# EAGLE design ioshield (EAGLE 7.2.0)
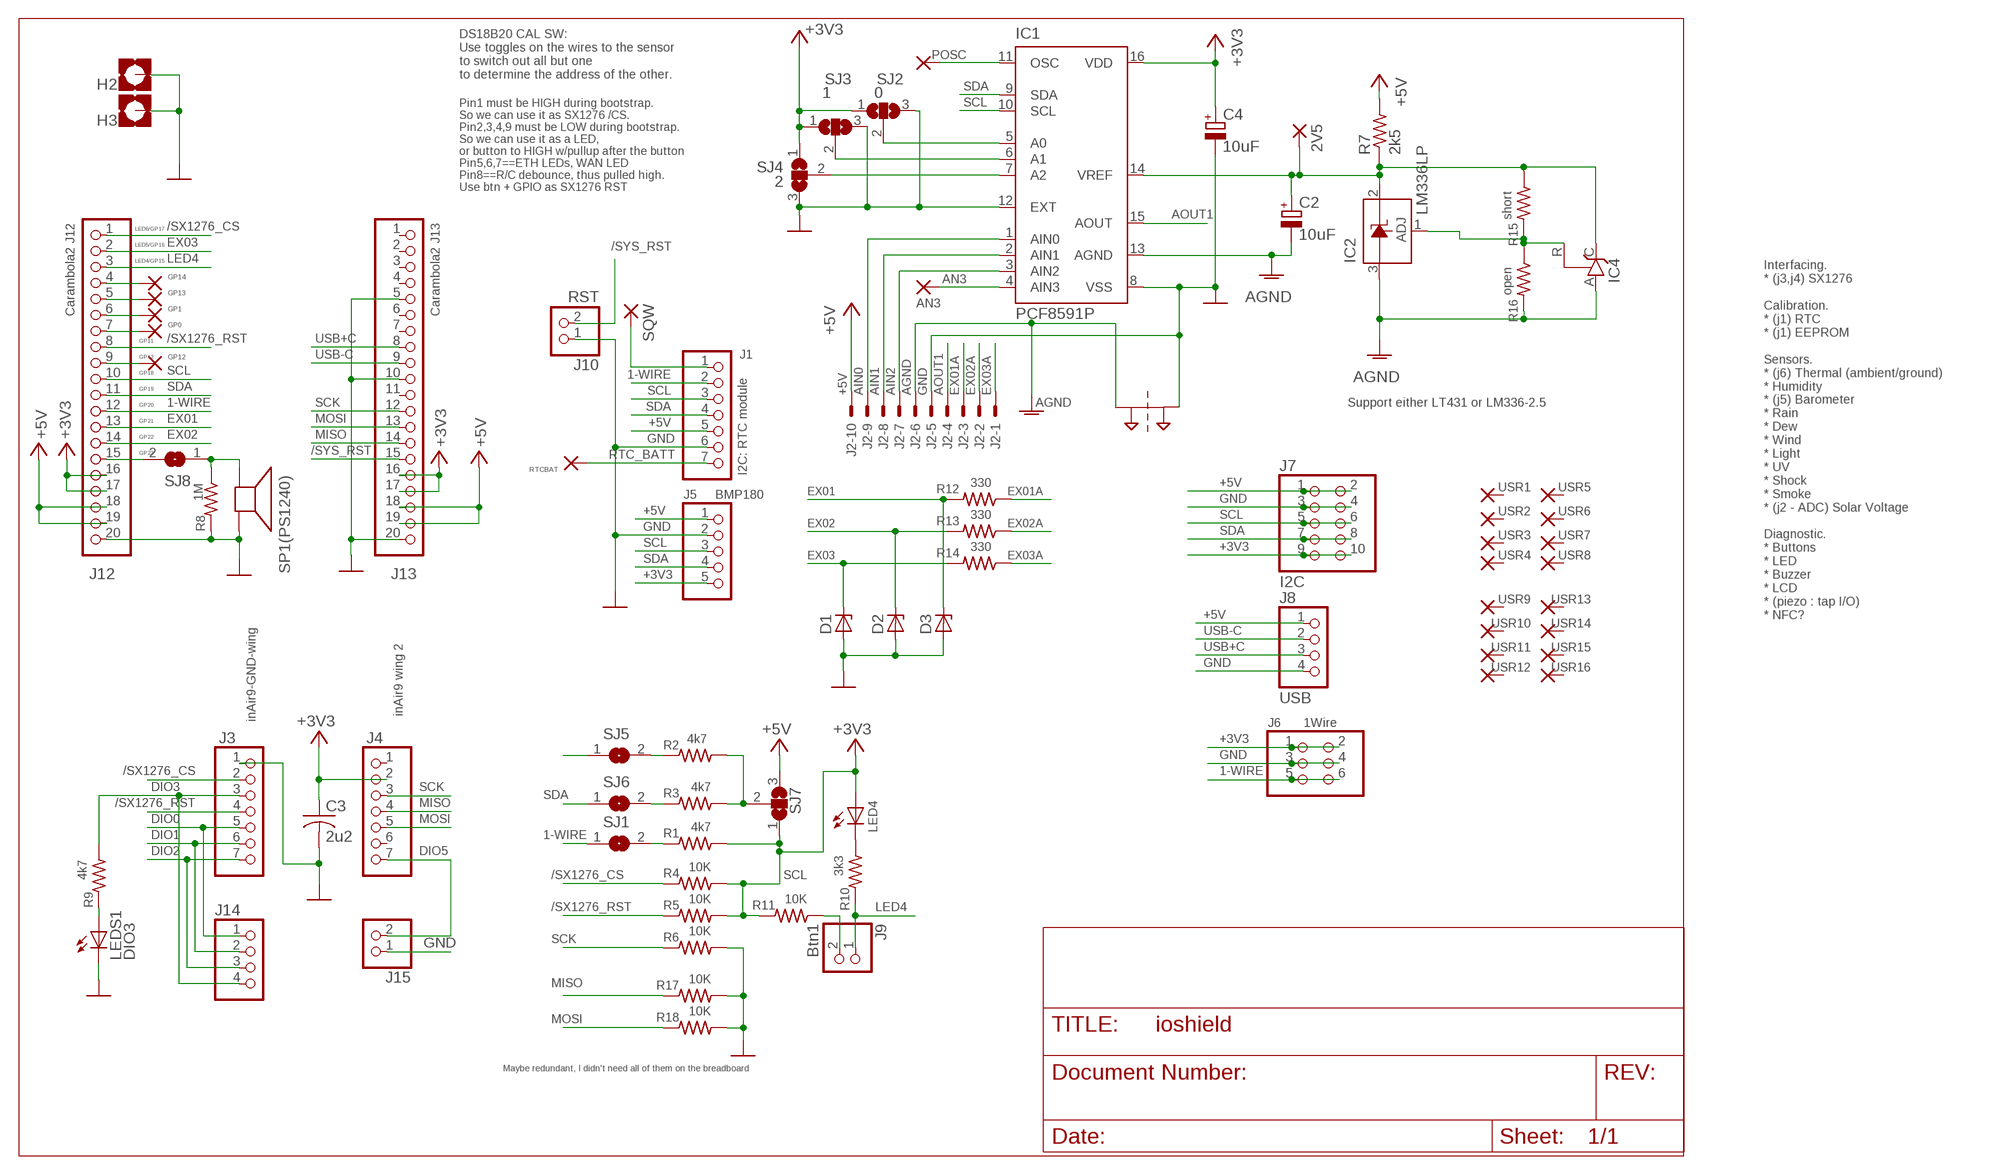
[diagram p0: schematic, sheet 1]

## Parts
2V5  2,54/0,8  [2,54/0,8]
AN3  AN3  2,54/0,8  [2,54/0,8]
C2  10uF  CPOL-EUE2.5-5  [E2,5-5]
C3  2u2  C-USC1206  [C1206]
C4  10uF  CPOL-EUE2.5-5  [E2,5-5]
D1  ZENER-DIODEZD-2.5  [ZDIO-2.5]
D2  ZENER-DIODEZD-2.5  [ZDIO-2.5]
D3  ZENER-DIODEZD-2.5  [ZDIO-2.5]
GP0  2,54/0,8  [2,54/0,8]
GP1  2,54/0,8  [2,54/0,8]
GP12  2,54/0,8  [2,54/0,8]
GP13  2,54/0,8  [2,54/0,8]
GP14  2,54/0,8  [2,54/0,8]
H2  MOUNT-PAD-SQUARE3.2  [3,2-PAD-SQUARE]
H3  MOUNT-PAD-SQUARE3.2  [3,2-PAD-SQUARE]
IC1  PCF8591P  [DIL16]
IC2  LM336LP  [TO92]
IC4  TL431CLP  [TO92-CLP]
J1  I2C: RTC module  PINHD-1X7  [1X07]
J2  22-23-2101  [22-23-2101]
J3  inAir9-GND-wing  PINHD-1X7  [1X07]
J4  inAir9 wing 2  PINHD-1X7  [1X07]
J5  BMP180  PINHD-1X5  [1X05]
J6  1Wire  PINHD-2X3  [2X03]
J7  I2C  PINHD-2X5  [2X05]
J8  USB  PINHD-1X4  [1X04]
J9  Btn1  PINHD-1X2  [1X02]
J10  RST  PINHD-1X2  [1X02]
J12  Carambola2 J12  PINHD-1X20  [1X20]
J13  Carambola2 J13  PINHD-1X20  [1X20]
J14  PINHD-1X4  [1X04]
J15  PINHD-1X2  [1X02]
LED4  LED3MM  [LED3MM]
LEDS1  DIO3  LED3MM  [LED3MM]
POSC  2,54/0,8  [2,54/0,8]
PT1  2PT_GND_TIE  [2PT_GND_TIE]
R1  4k7  R-US_M1206  [M1206]
R2  4k7  R-US_M1206  [M1206]
R3  4k7  R-US_M1206  [M1206]
R4  10K  R-US_M1206  [M1206]
R5  10K  R-US_M1206  [M1206]
R6  10K  R-US_M1206  [M1206]
R7  2k5  R-US_M1206  [M1206]
R8  1M  R-US_M1206  [M1206]
R9  4k7  R-US_M1206  [M1206]
R10  3k3  R-US_M1206  [M1206]
R11  10K  R-US_M1206  [M1206]
R12  330  R-US_M1206  [M1206]
R13  330  R-US_M1206  [M1206]
R14  330  R-US_M1206  [M1206]
R15  short  R-US_M1206  [M1206]
R16  open  R-US_M1206  [M1206]
R17  10K  R-US_M1206  [M1206]
R18  10K  R-US_M1206  [M1206]
RTCBAT  2,54/0,8  [2,54/0,8]
SJ1  SJ  [SJ]
SJ2  0  SJ2W  [SJ_2]
SJ3  1  SJ2W  [SJ_2]
SJ4  2  SJ2W  [SJ_2]
SJ5  SJ  [SJ]
SJ6  SJ  [SJ]
SJ7  SJ2W  [SJ_2]
SJ8  SJ  [SJ]
SP1(PS1240)  SPEAKER/AL11P  [AL11P]
SQW  2,54/0,8  [2,54/0,8]
USR1  1,6/0,8  [1,6/0,8]
USR2  1,6/0,8  [1,6/0,8]
USR3  1,6/0,8  [1,6/0,8]
USR4  1,6/0,8  [1,6/0,8]
USR5  1,6/0,8  [1,6/0,8]
USR6  1,6/0,8  [1,6/0,8]
USR7  1,6/0,8  [1,6/0,8]
USR8  1,6/0,8  [1,6/0,8]
USR9  1,6/0,8  [1,6/0,8]
USR10  1,6/0,8  [1,6/0,8]
USR11  1,6/0,8  [1,6/0,8]
USR12  1,6/0,8  [1,6/0,8]
USR13  1,6/0,8  [1,6/0,8]
USR14  1,6/0,8  [1,6/0,8]
USR15  1,6/0,8  [1,6/0,8]
USR16  1,6/0,8  [1,6/0,8]

## Nets
1-WIRE: J1.2 J6.5 J6.6 J12.12 SJ1.1
+3V3: C3.1 C4.+ IC1.16(VDD) J4.2 J5.5 J6.1 J6.2 J7.9 J7.10 J12.16 J12.17 J13.16 J13.17 LED4.A R1.1 R4.1 R5.1 R11.2 SJ2.1 SJ3.1 SJ4.1 SJ7.1
+5V: J1.5 J2.10 J5.1 J7.1 J7.2 J8.1 J12.18 J12.19 J13.18 J13.19 R7.2 SJ7.3
/SX1276_CS: J3.2 J12.1 R4.2
/SX1276_RST: J3.4 J12.8 R5.2
/SYS_RST: J10.2 J13.15
AGND: C2.- IC1.13(AGND) IC2.3(A) IC4.A J2.6 PT1.P$1 R16.2
AIN0: IC1.1(AIN0) J2.9
AIN1: IC1.2(AIN1) J2.8
AIN2: IC1.3(AIN2) J2.7
AIN3: AN3.1(P) IC1.4(AIN3)
AOUT1: IC1.15(AOUT) J2.4
DIO0: J3.5 J14.1
DIO1: J3.6 J14.2
DIO2: J3.7 J14.3
DIO3: J3.3 J14.4 R9.1
DIO5: J4.7 J15.2
EX01: D3.C J12.13 R12.2
EX01A: J2.3 R12.1
EX02: D2.C J12.14 R13.2
EX02A: J2.2 R13.1
EX03: D1.C J12.2 R14.2
EX03A: J2.1 R14.1
GND: C3.2 C4.- D1.A D2.A D3.A H2.B3,2(MOUNT) H3.B3,2(MOUNT) IC1.8(VSS) IC1.12(EXT) J1.6 J2.5 J3.1 J5.2 J6.3 J6.4 J7.3 J7.4 J8.4 J10.1 J12.20 J13.5 J13.10 J13.20 J15.1 LEDS1.K(C) PT1.P$2 R6.1 R8.2 R17.1 R18.1 SJ2.3 SJ3.3 SJ4.3 SP1(PS1240).-
LED4: J9.1 J12.3 R10.2
MISO: J4.4 J13.14 R17.2
MOSI: J4.5 J13.13 R18.2
N$1: IC2.1(ADJ) IC4.R R15.2 R16.1
N$2: R2.1 R3.1 SJ7.2
N$3: IC1.11(OSC) POSC.1(P)
N$6: J9.2 R11.1
N$7: R1.2 SJ1.2
N$8: GP12.1(P) J12.9
N$9: GP14.1(P) J12.4
N$10: R2.2 SJ5.2
N$11: R8.1 SJ8.1 SP1(PS1240).+
N$12: IC1.7(A2) SJ4.2
N$13: R3.2 SJ6.2
N$14: GP0.1(P) J12.7
N$15: LED4.K(C) R10.1
N$16: J1.1 SQW.1(P)
N$17: IC1.5(A0) SJ2.2
N$18: LEDS1.A R9.2
N$19: J12.15 SJ8.2
N$20: IC1.6(A1) SJ3.2
N$26: GP1.1(P) J12.6
N$27: GP13.1(P) J12.5
RTC_BATT: J1.7 RTCBAT.1(P)
SCK: J4.3 J13.12 R6.2
SCL: IC1.10(SCL) J1.3 J5.3 J7.5 J7.6 J12.10 SJ5.1
SDA: IC1.9(SDA) J1.4 J5.4 J7.7 J7.8 J12.11 SJ6.1
USB+C: J8.3 J13.8
USB-C: J8.2 J13.9
VREF2V5: 2V5.1(P) C2.+ IC1.14(VREF) IC2.2(C) IC4.C R7.1 R15.1
Unconnected: J4.1 J4.6 J13.1 J13.2 J13.3 J13.4 J13.6 J13.7 J13.11 USR1.1(P) USR2.1(P) USR3.1(P) USR4.1(P) USR5.1(P) USR6.1(P) USR7.1(P) USR8.1(P) USR9.1(P) USR10.1(P) USR11.1(P) USR12.1(P) USR13.1(P) USR14.1(P) USR15.1(P) USR16.1(P)

## Notes on the sheet
- DS18B20 CAL SW:
  Use toggles on the wires to the sensor
  to switch out all but one
  to determine the address of the other.
- Pin1 must be HIGH during bootstrap.
  So we can use it as SX1276 /CS.
  Pin2,3,4,9 must be LOW during bootstrap.
  So we can use it as a LED,
  or button to HIGH w/pullup after the button
  Pin5,6,7==ETH LEDs, WAN LED
  Pin8==R/C debounce, thus pulled high.
  Use btn + GPIO as SX1276 RST
- LED6/GP17
- LED5/GP16
- LED4/GP15
- GP11
- GP12
- GP18
- GP19
- GP20 | Support either LT431 or LM336-2.5
- GP21
- GP22
- GP23
- Interfacing.
  * (j3,j4) SX1276
  
  Calibration.
  * (j1) RTC
  * (j1) EEPROM
  
  Sensors.
  * (j6) Thermal (ambient/ground)
  * Humidity
  * (j5) Barometer
  * Rain
  * Dew
  * Wind
  * Light
  * UV
  * Shock
  * Smoke
  * (j2 - ADC) Solar Voltage
  
  Diagnostic.
  * Buttons
  * LED
  * Buzzer
  * LCD
  * (piezo : tap I/O)
  * NFC?
- Maybe redundant, I didn't need all of them on the breadboard

## Library data of the parts
2V5 AN3 GP0 GP1 GP12-GP14 POSC RTCBAT SQW = wirepad:2,54/0,8: THROUGH-HOLE PAD
C2 C4 = rcl:CPOL-EU: POLARIZED CAPACITOR, European symbol
C3 = rcl:C-US: CAPACITOR, American symbol
D1-D3 = diode:ZENER-DIODE: Z-Diode
H2 H3 = holes:MOUNT-PAD-SQUARE: MOUNTING PAD, square
IC1 = micro-philips:PCF8591: I2C-Bus D/A CONVERTER; MF: FARNELL; MPN: PCF8591P; OC_FARNELL: 396412; OC_NEWARK: 07WX3385
IC2 = linear:LM336: 2.5-V INTEGRATED REFERENCE CIRCUITS LM236 Source: http://focus.ti.com/lit/ds/symlink/lm336-2.5.pdf
IC4 = v-reg:TL431CLP: VOLTAGE REGULATOR
J1 J3 J4 = PINHEAD:PINHD-1X7: PIN HEADER
J2 = con-molex:22-23-2101: .100" (2.54mm) Center Header - 10 Pin; MF: MOLEX; MPN: Screw Terminal; OC_FARNELL: 1756828; OC_NEWARK: 94C0765
J5 = PINHEAD:PINHD-1X5: PIN HEADER
J6 = PINHEAD:PINHD-2X3: PIN HEADER
J7 = PINHEAD:PINHD-2X5: PIN HEADER
J8 J14 = PINHEAD:PINHD-1X4: PIN HEADER
J9 J10 J15 = PINHEAD:PINHD-1X2: PIN HEADER
J12 J13 = PINHEAD:PINHD-1X20
LED4 LEDS1 = led:LED: LED OSRAM: - CHIPLED LG R971, LG N971, LY N971, LG Q971, LY Q971, LO R971, LY R971 LH N974, LH R974 LS Q976, LO Q976, LY Q976 LO Q996 - Hyper CHIPLED LW Q18S LB Q993, LB Q99A, LB R99A - SideLED LS A670, LO A670, LY A670, LG A670, LP A670 LB A673, LV A673, LT A673, LW A673 LH A674 LY A675 LS A676, LA A676, LO A676, LY A676, LW A676 LS A679, LY A679, LG A679 - Hyper Micro SIDELED® LS Y876, LA Y876, LO Y876, LY Y876 LT Y87S - SmartLED LW L88C, LW L88S LB L89C, LB L89S, LG L890 LS L89K, LO L89K, LY L89K LS L896, LA L896, LO L896, LY L896 - TOPLED LS T670, LO T670, LY T670, LG T670, LP T670 LSG T670, LSP T670, LSY T670, LOP T670, LYG T670 LG T671, LOG T671, LSG T671 LB T673, LV T673, LT T673, LW T673 LH T674 LS T676, LA T676, LO T676, LY T676, LB T676, LH T676, LSB T676, LW T676 LB T67C, LV T67C, LT T67C, LS T67K, LO T67K, LY T67K, LW E67C LS E67B, LA E67B, LO E67B, LY E67B, LB E67C, LV E67C, LT E67C LW T67C LS T679, LY T679, LG T679 LS T770, LO T770, LY T770, LG T770, LP T770 LB T773, LV T773, LT T773, LW T773 LH T774 LS E675, LA E675, LY E675, LS T675 LS T776, LA T776, LO T776, LY T776, LB T776 LHGB T686 LT T68C, LB T68C - Hyper Mini TOPLED® LB M676 - Mini TOPLED Santana® LG M470 LS M47K, LO M47K, LY M47K Source: http://www.osram.convergy.de LUXEON: - LUMILED® LXK2-PW12-R00, LXK2-PW12-S00, LXK2-PW14-U00, LXK2-PW14-V00 LXK2-PM12-R00, LXK2-PM12-S00, LXK2-PM14-U00 LXK2-PE12-Q00, LXK2-PE12-R00, LXK2-PE12-S00, LXK2-PE14-T00, LXK2-PE14-U00 LXK2-PB12-K00, LXK2-PB12-L00, LXK2-PB12-M00, LXK2-PB14-N00, LXK2-PB14-P00, LXK2-PB14-Q00 LXK2-PR12-L00, LXK2-PR12-M00, LXK2-PR14-Q00, LXK2-PR14-R00 LXK2-PD12-Q00, LXK2-PD12-R00, LXK2-PD12-S00 LXK2-PH12-R00, LXK2-PH12-S00 LXK2-PL12-P00, LXK2-PL12-Q00, LXK2-PL12-R00 Source: www.luxeon.com KINGBRIGHT: KA-3528ASYC Source: www.kingbright.com
PT1 = SparkFun-Passives:2PT_GND_TIE: Package for connecting two ground nets in one place.
R1-R18 = rcl:R-US_: RESISTOR, American symbol
SJ1 SJ5 SJ6 SJ8 = jumper:SJ: SMD solder JUMPER
SJ2-SJ4 SJ7 = jumper:SJ2W: SMD solder JUMPER
SP1(PS1240) = adafruit:SPEAKER: SPEAKER Source: Buerklin Added PS12 (for part # PS1240 piezo) http://www.ladyada.net/library/pcb/eaglelibrary.html
USR1-USR16 = wirepad:1,6/0,8: THROUGH-HOLE PAD

## Board
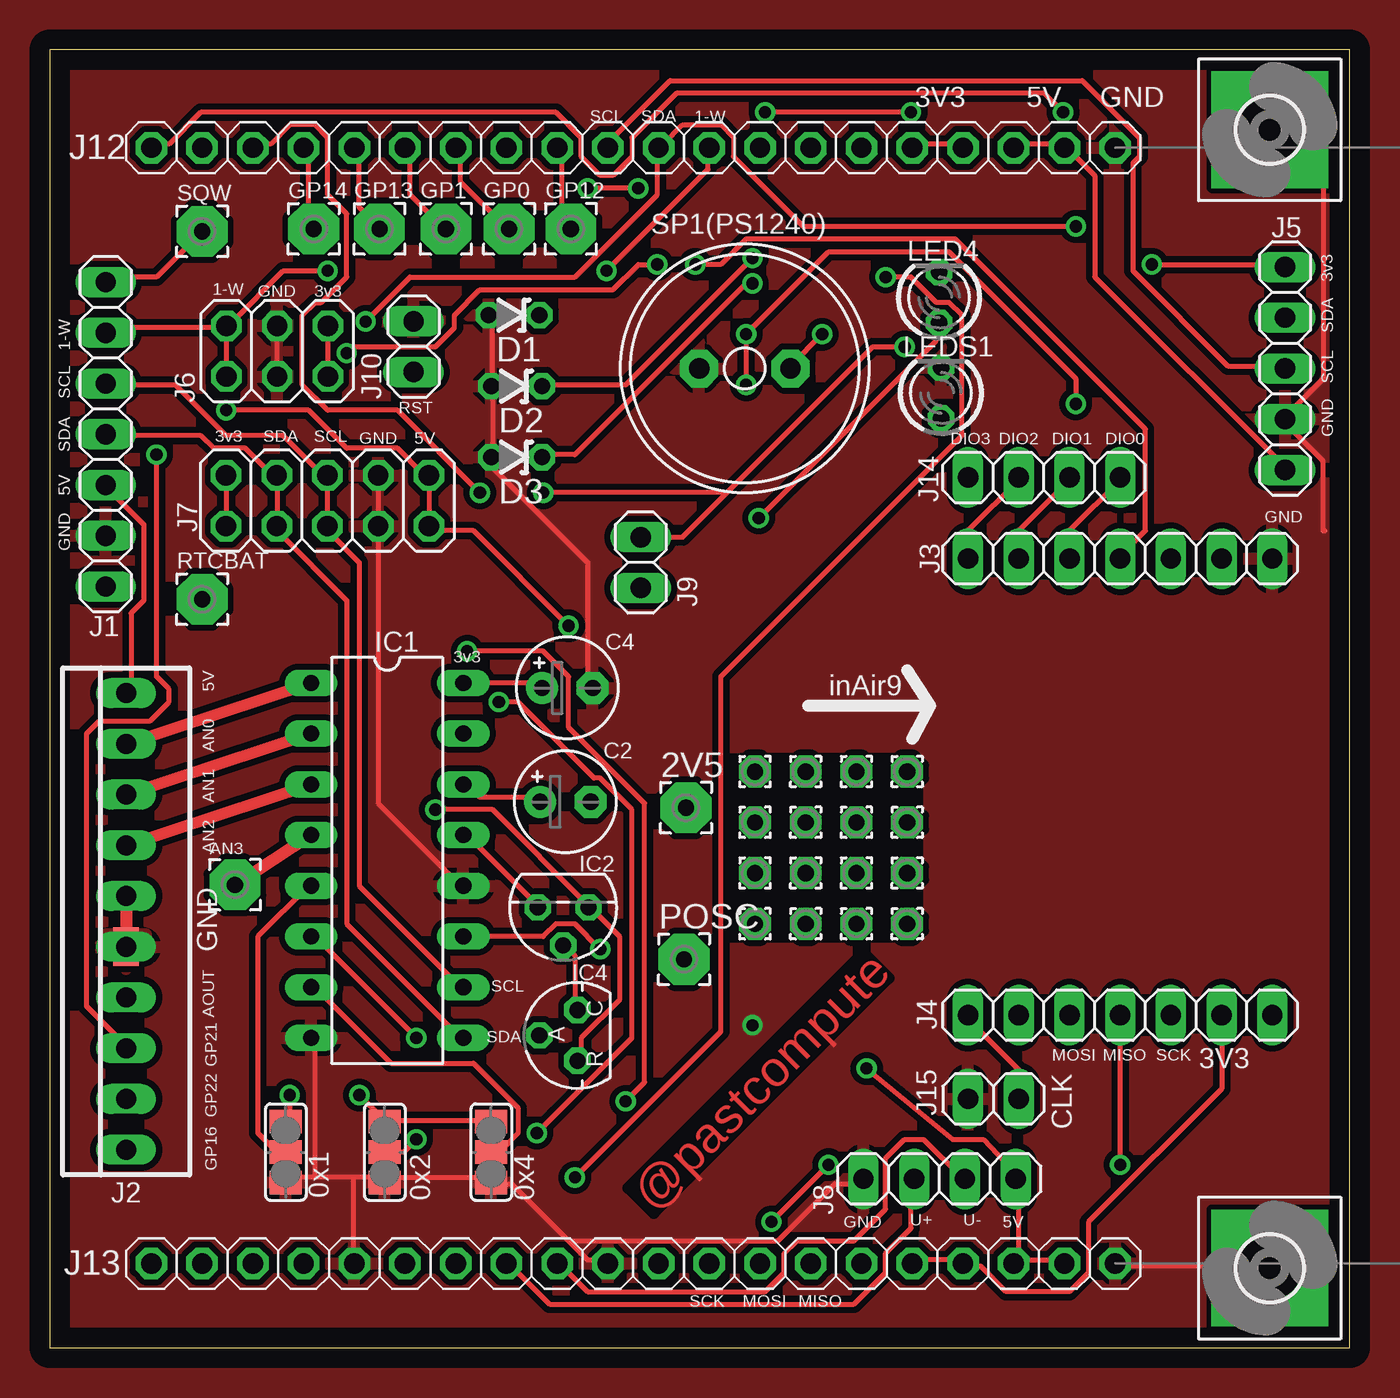
[diagram p1: board, top side]
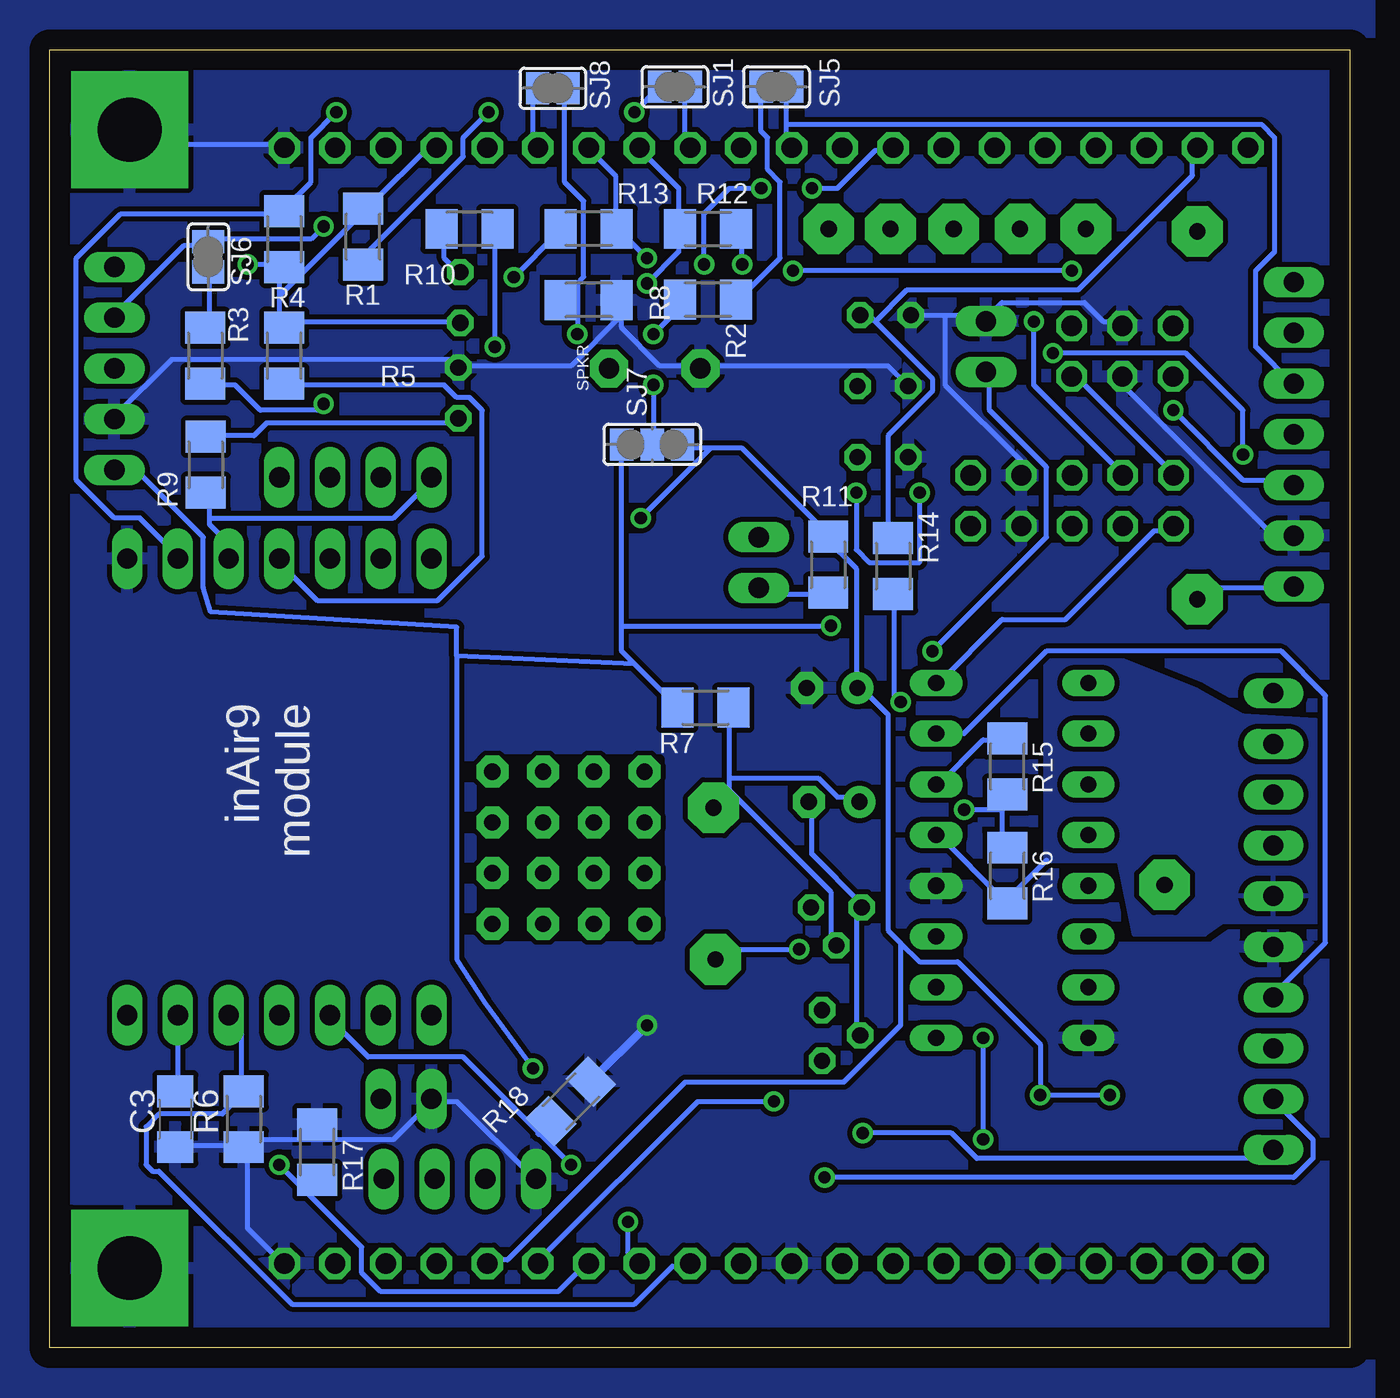
[diagram p2: board, bottom side, seen from below]

Size 65.08 x 65 mm. Coordinates in mm from the lower left corner, seen from the top.
Outline: 0,0 65.08,0 65.08,65 0,65 0,0
Copper layers (1*16): Top 0.035mm / dielectric 1.5mm / Bottom 0.035mm
Design rules "default *": minimum track width 10mil, minimum drill 24mil, track to track 8mil, track to pad 8mil, pad to pad 8mil, via to via 8mil, smd to smd 8mil, copper to edge 40mil, drill to drill 8mil, minimum pad ring 10mil, minimum via ring 8mil, stop-mask expansion 4mil, vias tented up to drill 0mil, thermal gap 10mil
tRestrict: area 34.5,20.6 to 43.4,29.5
bRestrict: area 34.5,20.6 to 43.4,29.5
vRestrict: area 44.8,18.4 to 65.2,37.7

### Footprints (pad centres in the part's own frame; a part is rotated, then mirrored left to right if it is on the bottom)
2,54/0,8 = drill 0.813 pad 2.54 octagon: 1 0,0
E2,5-5 = drill 0.813 pad 1.6: + -1.27,0 | drill 0.813 pad 1.6 octagon: - 1.27,0
C1206 = smd 1.6 x 1.8: 1 -1.4,0; 2 1.4,0
ZDIO-2.5 = drill 0.813 octagon: A 1.27,0; C -1.27,0
3,2-PAD-SQUARE = drill 3.2 pad 5.842 square: B3,2 0,0
DIL16 = drill 0.813 long: 1 -8.89,-3.81; 2 -6.35,-3.81; 3 -3.81,-3.81; 4 -1.27,-3.81; 5 1.27,-3.81; 6 3.81,-3.81; 7 6.35,-3.81; 8 8.89,-3.81; 9 8.89,3.81; 10 6.35,3.81; 11 3.81,3.81; 12 1.27,3.81; 13 -1.27,3.81; 14 -3.81,3.81; 15 -6.35,3.81; 16 -8.89,3.81
TO92 = drill 0.813 octagon: 1 -1.27,0; 2 0,1.905; 3 1.27,0
TO92-CLP = drill 0.813 octagon: A 0,1.905; C 1.27,0; R -1.27,0
1X07 = drill 1.016 long: 1 -7.62,0; 2 -5.08,0; 3 -2.54,0; 4 0,0; 5 2.54,0; 6 5.08,0; 7 7.62,0
22-23-2101 = drill 1 long: 1 -11.43,0; 2 -8.89,0; 3 -6.35,0; 4 -3.81,0; 5 -1.27,0; 6 1.27,0; 7 3.81,0; 8 6.35,0; 9 8.89,0; 10 11.43,0
1X05 = drill 1.016 long: 1 -5.08,0; 2 -2.54,0; 3 0,0; 4 2.54,0; 5 5.08,0
2X03 = drill 1.016 octagon: 1 -2.54,-1.27; 2 -2.54,1.27; 3 0,-1.27; 4 0,1.27; 5 2.54,-1.27; 6 2.54,1.27
2X05 = drill 1.016 octagon: 1 -5.08,-1.27; 2 -5.08,1.27; 3 -2.54,-1.27; 4 -2.54,1.27; 5 0,-1.27; 6 0,1.27; 7 2.54,-1.27; 8 2.54,1.27; 9 5.08,-1.27; 10 5.08,1.27
1X04 = drill 1.016 long: 1 -3.81,0; 2 -1.27,0; 3 1.27,0; 4 3.81,0
1X02 = drill 1.016 long: 1 -1.27,0; 2 1.27,0
1X20 = drill 1.016 pad 1.575 octagon: 1 -24.13,0; 2 -21.59,0; 3 -19.05,0; 4 -16.51,0; 5 -13.97,0; 6 -11.43,0; 7 -8.89,0; 8 -6.35,0; 9 -3.81,0; 10 -1.27,0; 11 1.27,0; 12 3.81,0; 13 6.35,0; 14 8.89,0; 15 11.43,0; 16 13.97,0; 17 16.51,0; 18 19.05,0; 19 21.59,0; 20 24.13,0
LED3MM = drill 0.813 octagon: A -1.27,0; K 1.27,0
2PT_GND_TIE = smd 1.27 x 0.635: P$1 0,0.635; P$2 0,-0.635
M1206 = smd 1.6 x 2: 1 -1.4,0; 2 1.4,0
SJ = smd 1.168 x 1.6: 1 -0.762,0; 2 0.762,0
SJ_2 = smd 1.168 x 1.6: 1 -1.524,0; 2 0,0; 3 1.524,0
AL11P = drill 1.016 pad 1.905 octagon: + 2.286,0; - -2.286,0
1,6/0,8 = drill 0.813 pad 1.6 octagon: 1 0,0

### Placement (x,y rotation side)
2V5  31.85,27.05 0 top
AN3  9.27,23.19 0 top
C2  25.81,27.35 0 top
C3  58.8,11.46 270 bottom
C4  25.91,33.05 0 top
D1  23.24,51.72 180 top
D2  23.37,48.16 180 top
D3  23.37,44.61 180 top
GP0  22.99,56.04 0 top
GP1  19.83,56.04 0 top
GP12  26.09,56.04 0 top
GP13  16.5,56.04 0 top
GP14  13.21,56.04 0 top
H2  61.08,61 0 top
H3  61.08,4 0 top
IC1  16.89,24.41 270 top
IC2  25.7,22.06 180 top
IC4  26.42,15.65 90 top
J1  2.79,45.75 270 top
J2  3.82,21.36 90 top
J3  53.59,39.53 180 top
J4  53.59,16.67 180 top
J5  61.85,49.05 90 top
J6  11.38,49.91 180 top
J7  13.9,42.43 180 top
J8  44.55,8.47 180 top
J9  29.58,39.33 270 top
J10  18.21,50.14 270 top
J12  29.21,60.1 0 top
J13  29.21,4.23 0 top
J14  49.78,43.59 180 top
J15  47.24,12.47 0 top
LED4  44.53,52.6 90 top
LEDS1  44.62,47.82 90 top
POSC  31.75,19.46 0 top
PT1  3.81,20.09 180 top
R1  49.4,55.66 270 bottom
R2  32.13,52.49 0 bottom
R3  57.3,49.69 90 bottom
R4  53.34,55.53 90 bottom
R5  53.34,49.69 270 bottom
R6  55.37,11.46 90 bottom
R7  32.26,32.06 180 bottom
R8  38.1,52.48 0 bottom
R9  57.28,44.23 90 bottom
R10  44.07,56.04 0 bottom
R11  26.11,39.22 90 bottom
R12  32.13,56.04 180 bottom
R13  38.1,56.04 0 bottom
R14  22.86,39.15 90 bottom
R15  17.15,29.11 270 bottom
R16  17.15,23.65 270 bottom
R17  51.69,9.81 270 bottom
R18  38.99,12.35 225 bottom
RTCBAT  7.62,37.49 0 top
SJ1  33.78,63.15 180 bottom
SJ2  11.81,9.81 270 top
SJ3  16.76,9.81 270 top
SJ4  22.1,9.81 270 top
SJ5  28.7,63.15 180 bottom
SJ6  57.15,54.64 270 bottom
SJ7  34.92,45.24 180 bottom
SJ8  39.9,63.07 180 bottom
SP1(PS1240)  34.8,49.05 0 top
SQW  7.62,55.91 0 top
USR1  35.31,28.86 0 top
USR2  35.31,26.32 0 top
USR3  35.31,23.78 0 top
USR4  35.31,21.24 0 top
USR5  37.85,28.86 0 top
USR6  37.85,26.32 0 top
USR7  37.85,23.78 0 top
USR8  37.85,21.24 0 top
USR9  42.93,21.24 0 top
USR10  40.39,28.86 0 top
USR11  40.39,21.24 0 top
USR12  42.93,28.86 0 top
USR13  40.39,26.32 0 top
USR14  42.93,26.32 0 top
USR15  40.39,23.78 0 top
USR16  42.93,23.78 0 top

### Tracks (layer width: path | path; a pad name or v marks a point on that pad's centre or on a via)
1-WIRE  (via drill 0.61)
  Top 0.254: 8.83,51.08 2.79,51.08 J1.2 | 8.83,51.08 8.83,48.86 J6.6 | 8.83,51.08 J6.5 9.14,51.4 11.68,53.94 v13.91,53.94 | v27.88,53.94 32.96,59.02 32.96,59.97 J12.12
  Bottom 0.254: SJ1.1 33.27,63.15 33.27,60.29 J12.12 | v13.91,53.94 v27.88,53.94
+3V3  (via drill 0.61)
  Top 0.254: J13.16 43.43,4.41 45.66,4.41 J13.17 45.97,4.09 46.61,4.09 47.88,2.82 51.05,2.82 52.01,3.78 52.01,6.31 58.67,12.98 J4.2 | J12.16 43.43,60.29 45.66,60.29 J12.17 | v55.18,54.26 61.85,54.26 J5.5 | J7.10 8.83,41.24 8.83,43.46 J7.9 | J6.2 13.91,48.86 13.91,51.08 J6.1 | v12,12.67 12,11.4 SJ2.1 | 16.76,11.4 v15.49,12.67 | 16.76,11.4 21.84,11.4 SJ4.1 | 16.76,11.4 SJ3.1 | IC1.16 24.38,33.3 C4.+ | v35.5,41.56 44.39,50.45 44.39,51.08 LED4.A
  Bottom 0.254: J4.2 58.67,12.98 C3.1 | J12.17 45.97,60.29 49.15,57.11 R1.1 49.47,56.8 53.59,52.67 | 53.59,52.67 53.59,53.94 R4.1 53.59,54.26 v55.18,54.26 | 53.59,52.67 53.59,51.4 R5.1 53.28,51.4 44.7,51.4 LED4.A | J7.9 8.83,43.78 13.91,48.86 J6.2 | v12,12.67 v15.49,12.67 15.49,15.21 19.62,19.33 21.53,19.33 22.48,20.29 | 32,45.05 30.42,45.05 26.29,40.92 R11.2 26.29,40.61 24.7,39.02 24.7,33.3 C4.+ 24.38,32.99 23.11,31.72 23.11,20.92 22.48,20.29 | 32,45.05 33.27,45.05 SJ7.1 | J7.10 8.83,40.92 9.78,40.92 14.22,36.48 17.4,36.48 20.57,33.3 IC1.16 | 32,45.05 v35.5,41.56 | 22.48,20.29 22.48,16.16 25.34,13.3 33.27,13.3 42.16,4.41 43.12,4.41 J13.16
+5V  (via drill 0.61)
  Top 0.254: J5.1 61.85,44.1 52.32,53.62 52.32,58.7 51.05,59.97 J12.19 50.74,60.29 48.51,60.29 J12.18 | J2.10 4.06,32.99 4.06,36.8 4.7,37.43 4.7,41.24 2.79,43.15 J1.5 | 48.51,4.41 48.51,8.22 J8.1 48.51,8.54 46.74,10.44 45.21,10.44 v40.89,14 | 48.51,4.41 50.74,4.41 J13.19 | 48.51,4.41 J13.18 | v25.97,36.16 21.21,40.92 18.99,40.92 J7.2 18.99,41.24 18.99,43.46 J7.1 18.67,43.78 17.4,45.05 14.86,45.05 12.95,46.95 v8.83,46.95
  Bottom 0.254: 36.45,36.16 36.45,34.89 35.81,34.26 | 36.45,36.16 SJ7.3 | 35.81,34.26 33.91,32.35 R7.2 | 36.45,36.16 v25.97,36.16 | v40.89,14 43.31,17.3 44.7,19.46 44.7,34.64 | 35.81,34.26 44.7,34.64 | v8.83,46.95 5.33,43.46 2.79,43.46 J1.5 | 44.7,34.64 44.7,36.1 57.02,36.86 57.4,38.06 57.4,40.61 60.58,43.78 61.85,43.78 J5.1
/SX1276_CS  (via drill 0.61)
  Top 0.254: v50.74,61.88 49.78,62.83 31.37,62.83 29.15,60.61 29.15,59.66 28.19,58.7 27.56,58.7 26.61,59.66 26.61,60.61 25.34,61.88 7.56,61.88 5.97,60.29 5.33,60.29 J12.1
  Bottom 0.254: J3.2 58.67,39.65 60.58,41.56 61.85,41.56 63.75,43.46 63.75,54.58 61.53,56.8 53.59,56.8 R4.2 53.28,57.11 52.01,58.39 52.01,60.61 v50.74,61.88
/SX1276_RST  (via drill 0.61)
  Top 0.254: v29.46,58.07 v26.92,58.07 | v32.32,54.26 33.59,54.26 34.86,55.53 45.34,55.53 54.86,46 54.86,40.92 53.59,39.65 J3.4
  Bottom 0.254: R5.2 53.28,48.23 45.34,48.23 44.7,47.59 44.07,47.59 43.43,46.95 43.43,39.65 45.66,37.43 51.69,37.43 53.59,39.34 J3.4 | v26.92,58.07 25.65,58.07 23.75,59.97 23.11,59.97 J12.8 | v29.46,58.07 31.05,58.07 32.32,56.8 v32.32,54.26
/SYS_RST  (via drill 0.61)
  Top 0.254: v20.89,34.89 24.7,34.89 25.97,33.62 25.97,31.08 29.78,27.27 29.78,13.3 v28.83,12.35
  Bottom 0.254: v20.89,34.89 15.18,40.61 15.18,44.1 18.03,46.95 18.03,48.86 J10.2 | v28.83,12.35 32.64,12.35 40.58,4.41 J13.15
AGND
  Top 0.254: IC1.13 20.89,25.68 24.38,22.19 IC2.3
  Top 0.61: J2.6 3.81,20.73
  Bottom 0.254: 15.18,24.41 17.08,22.51 R16.2 17.4,22.51 20.57,25.68 IC1.13 | IC4.A 24.7,15.84 24.7,21.87 IC2.3 24.38,22.19 26.92,24.73 26.92,27.27 C2.-
  pour Bottom (isolate 0.254, rank 3): 15.24,35.97 15.24,24.41 11.56,24.41 10.79,20.73 7.24,20.73 6.35,21.37 1.27,21.37 1.27,31.4 5.33,31.65 7.62,32.92
AIN0
  Top 0.61: J2.9 IC1.1
AIN1
  Top 0.61: J2.8 IC1.2
AIN2
  Top 0.61: J2.7 IC1.3
AIN3
  Top 0.61: IC1.4 AN3.1
AOUT1
  Bottom 0.254: IC1.15 19.3,30.76 15.18,34.89 3.43,34.89 1.21,32.67 1.21,20.29 3.75,17.75 J2.4
DIO0
  Top 0.254: J3.5 51.05,40.92 53.59,43.46 J14.1
DIO1
  Top 0.254: J3.6 48.51,40.92 51.05,43.46 J14.2
DIO2
  Top 0.254: J3.7 45.97,40.92 48.51,43.46 J14.3
DIO3
  Bottom 0.254: 57.09,41.56 57.09,41.24 56.13,40.29 J3.3 | 57.09,41.56 57.09,42.51 R9.1 | 57.09,41.56 47.88,41.56 45.97,43.46 J14.4
DIO5
  Top 0.254: J15.2 48.51,13.94 45.97,16.48 J4.7
EX01  (via drill 0.61)
  Top 0.254: v35.18,53.31 34.86,53.31 26.29,44.73 24.7,44.73 D3.C
  Bottom 0.254: J12.13 35.5,59.97 33.59,58.07 33.59,56.16 R12.2 33.59,55.85 33.59,54.89 v35.18,53.31
EX01A  (via drill 0.61)
  Top 0.254: v30.42,54.26 29.46,54.26 28.19,52.99 21.53,52.99 20.26,51.72 20.26,51.08 19.3,50.13 15.18,50.13 v14.86,49.81 | v5.33,44.73 5.33,33.62 5.97,32.99 5.97,32.35 5.02,31.4 2.48,31.4 1.84,30.76 1.84,17.11 3.75,15.21 J2.3
  Bottom 0.254: v30.42,54.26 30.42,55.85 R12.1 | v14.86,49.81 8.19,49.81 5.33,46.95 v5.33,44.73
EX02  (via drill 0.61)
  Top 0.254: v35.18,54.58 28.83,48.23 24.7,48.23 D2.C
  Bottom 0.254: J12.14 38.04,59.97 36.77,58.7 36.77,56.16 R13.2 36.45,55.85 v35.18,54.58
EX02A  (via drill 0.61)
  Top 0.254: v41.85,53.62 43.12,53.62 44.39,52.35 45.02,52.35 45.66,51.72 45.66,45.69 33.59,33.62 33.59,15.84 v26.29,8.54
  Bottom 0.254: v41.85,53.62 39.62,55.85 R13.1 | v26.29,8.54 2.79,8.54 1.84,9.49 1.84,10.44 3.75,12.35 J2.2
EX03
  Bottom 0.254: 23.75,51.4 24.07,51.72 D1.C | 23.75,51.4 20.89,48.54 20.89,47.91 23.11,45.69 23.11,40.61 R14.2 | 23.75,51.4 22.16,52.99 13.59,52.99 7.87,58.7 7.87,59.97 J12.2
EX03A  (via drill 0.61)
  Top 0.254: v22.48,32.35 23.43,32.35 27.24,28.54 27.56,28.54 29.15,26.95 29.15,15.52 v24.38,10.76
  Bottom 0.254: v22.48,32.35 22.8,32.67 22.8,37.43 R14.1 | v24.38,10.76 19.94,10.76 18.67,9.49 4.38,9.49 4.06,9.81 J2.1
GND  (via drill 0.61 pad 1.02)
  Top 0.254: J13.20 53.59,4.09 60.9,4.09 H3.B3,2 | 16.76,8.54 15.18,8.54 | 15.18,8.54 13.27,8.54 | 13.27,8.54 12,8.54 SJ2.3 | 16.76,8.54 21.84,8.54 SJ4.3 22.16,8.22 23.11,8.22 25.97,5.36 | 16.76,8.54 SJ3.3 | 13.27,8.54 13.27,15.52 IC1.8 | 15.18,8.54 15.18,4.41 J13.5 | 25.97,5.36 26.92,4.41 27.88,4.41 J13.10 | 25.97,5.36 36.45,5.36 39.31,8.22 40.58,8.22 J8.4 | 63.86,40.92 63.75,40.92 63.75,44.42 61.85,46.32 J5.2 61.85,46.64 63.75,48.54 63.75,58.39 61.21,60.92 H2.B3,2 | J6.3 11.37,51.08 11.37,48.86 J6.4 | J7.3 16.45,43.46 16.45,41.24 J7.4 16.45,40.92 16.45,27.27 20.57,23.14 IC1.12 | D1.A 22.16,51.72 22.16,48.23 D2.A 22.16,47.91 22.16,44.73 D3.A 21.84,44.42 26.92,39.34 26.92,33.3 C4.-
  Top 0.61: J2.5 3.81,19.46
  Bottom 0.254: 45.97,12.35 44.7,12.35 40.89,8.54 J8.4 | C3.2 58.67,10.13 55.5,10.13 R6.1 | R6.1 55.18,9.81 55.18,6 53.59,4.41 J13.20 | 45.97,12.35 47.88,10.44 54.86,10.44 55.18,10.13 R6.1 | 45.97,12.35 J15.1 | J12.20 53.59,60.29 60.26,60.29 60.9,60.92 H2.B3,2 | J1.6 2.79,40.92 4.06,40.92 11.68,48.54 J6.4 | 36.45,51.72 36.45,51.08 34.54,49.18 32.64,49.18 SP1(PS1240).- 32.32,49.18 23.11,49.18 D2.A | 36.45,51.72 36.45,52.35 R8.2 36.45,51.72 | 36.45,51.72 38.99,49.18 44.39,49.18 LEDS1.K 44.7,49.18 45.02,49.5 58.99,49.5 61.85,46.64 J5.2 | D1.A 20.26,51.72 | 20.26,51.72 18.35,51.72 J10.1 18.03,51.72 17.4,52.35 13.27,52.35 12.32,51.4 11.68,51.4 J6.3 | 20.26,51.72 20.26,48.23 16.45,44.42 16.45,43.78 J7.3
  Bottom 0.406: R18.1 v35.18,16.16
  pour Top (isolate 0.254, rank 3): 44.32,36.99 60.2,36.99 60.71,40.92 65.08,40.92 65.08,16.16 62.48,16.16 62.48,19.33 44.32,19.33
  pour Top (isolate 0.305, rank 4): -3.56,68.86 69.47,68.86 69.47,-4.8 -3.56,-4.8
  pour Bottom (isolate 0.254, rank 6): -1.02,73.31 67.56,73.31 67.56,-13.69 -1.02,-13.69
LED4  (via drill 0.61)
  Top 0.254: v42.8,50.13 41.21,50.13 33.91,42.83 | 33.91,42.83 31.69,40.61 29.78,40.61 J9.1 | v21.53,42.83 17.4,46.95 13.91,46.95 12.64,48.23 12.64,51.72 13.27,52.35 13.59,52.35 14.86,53.62 14.86,56.8 13.91,57.75 13.91,60.61 13.27,61.24 12,61.24 11.05,60.29 10.41,60.29 J12.3 | 33.91,42.83 v24.7,42.83
  Bottom 0.254: v42.8,50.13 42.8,55.85 R10.2 | v21.53,42.83 21.53,39.34 24.07,39.34 24.7,39.97 v24.7,42.83
MISO  (via drill 0.61)
  Top 0.254: v53.59,9.17 J4.4
  Bottom 0.254: v53.59,9.17 52.32,7.9 49.47,5.04 49.47,3.78 48.51,2.82 39.62,2.82 38.35,4.09 J13.14
  Bottom 0.406: R17.2 52.32,7.9
MOSI  (via drill 0.61)
  Top 0.254: v36.13,6.31 v38.99,9.17
  Bottom 0.254: v38.99,9.17 40.58,10.76 44.39,14.57 49.15,14.57 51.05,16.48 J4.5 | v36.13,6.31 36.13,4.73 35.81,4.41 J13.13
  Bottom 0.406: R18.2 40.58,10.76
N$1  (via drill 0.61)
  Top 0.254: IC4.R 26.61,14.57 26.61,15.52 28.51,17.43 28.51,20.6 27.24,21.87 IC2.1 26.92,22.19 22.16,26.95 v19.3,26.95
  Bottom 0.254: 17.4,26.95 17.4,27.59 R15.2 17.4,26.95 | 17.4,26.95 17.4,25.37 R16.1 | v19.3,26.95 17.4,26.95
N$2  (via drill 0.61)
  Top 0.254: v34.86,48.23 v34.86,50.77 38.99,54.89 45.02,54.89 51.37,48.54 v51.37,47.27
  Bottom 0.254: v34.86,48.23 34.86,45.37 SJ7.2 | v34.86,50.77 33.27,52.35 R2.1 | v51.37,47.27 51.69,46.95 54.55,46.95 55.82,48.23 57.09,48.23 R3.1
N$3  (via drill 0.61)
  Top 0.254: IC1.11 24.7,20.6 25.34,21.24 26.29,21.24 v27.56,19.97
  Bottom 0.254: v27.56,19.97 31.37,19.97 31.69,19.65 POSC.1
N$6
  Bottom 0.254: R11.1 26.29,37.75 29.46,37.75 J9.2
N$7  (via drill 0.61)
  Top 0.254: v43.12,61.88 v35.81,61.88
  Bottom 0.254: v35.81,61.88 SJ1.2 | v43.12,61.88 44.39,60.61 44.39,59.66 49.15,54.89 49.15,54.26 R1.2
N$8
  Top 0.254: J12.9 25.65,59.97 25.65,56.48 25.97,56.16 GP12.1
N$9
  Top 0.254: J12.4 12.95,59.97 12.95,56.16 GP14.1
N$10
  Bottom 0.254: SJ5.2 29.46,60.92 29.15,60.61 29.15,59.02 28.51,58.39 28.51,54.58 30.42,52.67 R2.2
N$11  (via drill 0.61)
  Top 0.254: v38.67,50.77 37.08,49.18 SP1(PS1240).+
  Bottom 0.254: 38.67,53.31 39.31,52.67 R8.1 | 38.67,53.31 38.35,53.62 38.35,57.43 39.31,58.39 39.31,62.83 SJ8.1 | 38.67,53.31 v38.67,50.77
N$12
  Top 0.254: SJ4.2 22.48,9.81 23.43,10.76 23.43,12.03 21.21,14.25 17.08,14.25 13.27,18.06 IC1.7
N$13
  Bottom 0.254: SJ6.2 57.09,53.62 57.09,51.4 R3.2
N$14
  Top 0.254: J12.7 20.57,59.97 20.57,58.39 22.8,56.16 GP0.1
N$15
  Bottom 0.254: R10.1 45.34,55.85 45.34,54.58 44.7,53.94 LED4.K
N$16
  Top 0.254: SQW.1 5.33,53.62 2.79,53.62 J1.1
N$17
  Top 0.254: SJ2.2 11.37,9.81 10.41,10.76 10.41,20.6 12.95,23.14 IC1.5
N$18
  Bottom 0.254: R9.2 57.09,45.69 54.86,45.69 54.23,46.32 44.7,46.32 LEDS1.A
N$19
  Bottom 0.254: SJ8.2 40.89,62.83 40.89,60.29 J12.15
N$20  (via drill 0.61)
  Top 0.254: SJ3.2 17.72,9.81 v18.35,10.44 | v18.35,15.52 13.27,20.6 IC1.6
  Bottom 0.254: v18.35,15.52 v18.35,10.44
N$26
  Top 0.254: J12.6 18.03,59.97 18.03,57.75 19.62,56.16 GP1.1
N$27
  Top 0.254: J12.5 15.49,59.97 15.49,57.11 16.45,56.16 GP13.1
RTC_BATT
  Bottom 0.254: J1.7 2.79,38.06 7.24,38.06 7.56,37.75 RTCBAT.1
SCK
  Bottom 0.254: J4.3 56.13,16.48 55.5,15.84 55.5,12.98 R6.2 55.5,12.67 56.45,11.71 59.63,11.71 60.26,11.08 60.26,9.17 59.94,8.86 59.63,8.86 52.96,2.19 35.81,2.19 33.91,4.09 33.27,4.09 J13.12
SCL
  Top 0.254: J5.3 61.85,49.18 58.99,49.18 54.23,53.94 54.23,59.34 54.55,59.66 54.55,60.61 51.69,63.47 31.05,63.47 27.88,60.29 J12.10 | IC1.10 20.57,18.06 15.49,23.14 15.49,39.34 13.91,40.92 J7.6 13.91,41.24 13.91,43.46 J7.5 13.59,43.78 11.68,45.69 8.83,45.69 6.29,48.23 2.79,48.23 J1.3
  Bottom 0.254: 28.19,61.24 28.19,60.29 J12.10 | 28.19,61.24 28.19,63.15 SJ5.1 | 28.19,61.24 4.38,61.24 3.75,60.61 3.75,54.89 4.7,53.94 4.7,50.13 2.79,48.23 J1.3
SDA  (via drill 0.61)
  Top 0.254: IC1.9 20.57,15.52 14.86,21.24 14.86,37.43 11.37,40.92 J7.8 11.37,41.24 11.37,43.46 J7.7 11.05,43.78 9.78,45.05 8.19,45.05 7.56,45.69 2.79,45.69 J1.4 | v15.81,51.4 18.03,53.62 26.29,53.62 30.42,57.75 30.42,59.97 J12.11 30.73,60.29 31.69,61.24 33.59,61.24 34.23,60.61 34.23,59.66 37.72,56.16 v51.37,56.16
  Bottom 0.254: J5.4 61.85,51.72 58.36,55.21 57.4,55.21 SJ6.1 57.09,55.53 52.01,55.53 v51.37,56.16 | v15.81,51.4 15.81,48.23 11.37,43.78 J7.7
USB+C
  Top 0.254: J8.3 43.12,8.22 43.12,6 41.85,4.73 41.85,3.78 40.26,2.19 25.02,2.19 23.11,4.09 J13.8
USB-C
  Top 0.254: J8.2 45.66,8.54 43.75,10.44 42.8,10.44 41.85,9.49 41.85,6.95 40.26,5.36 37.4,5.36 36.77,4.73 36.77,3.78 35.81,2.82 26.92,2.82 25.65,4.09 J13.9
VREF2V5
  Top 0.254: C2.+ 24.38,27.59 21.53,27.59 20.89,28.22 IC1.14 | IC4.C 26.29,17.11 26.29,19.65 25.97,19.97 IC2.2
  Bottom 0.254: R15.1 17.4,30.45 18.35,30.45 20.57,28.22 IC1.14 | 31.05,27.91 31.05,28.54 | 31.05,28.54 31.05,32.03 R7.1 | 31.05,27.91 31.69,27.27 2V5.1 31.05,27.91 | 31.05,27.91 25.97,22.83 25.97,20.29 IC2.2 | 31.05,28.54 26.61,28.54 25.65,27.59 24.7,27.59 C2.+

### Text on the board
Top: @pastcompute
tNames: SCL | SDA | 3V3 | 5V | GND | 1-W | 3v3 | GND | 3v3 | 1-W | 1-W | SDA | SCL | SCL | RST | 3v3 | SDA | SCL | GND | 5V | DIO3 | DIO2 | DIO1 | DIO0 | GND | SDA | 5V | GND | GND | 5V | 3v3 | inAir9 | AN0 | AN1 | AN2 | AOUT | GND | SCL | GP21 | SDA | MOSI | MISO | SCK | 3V3 | GP22 | GP16 | CLK | 0x1 | 0x2 | 0x4 | GND | U+ | U- | 5V | SCK | MOSI | MISO
bNames: SPKR | inAir9 / module
Carambola: c2top.bmp | Scaled at 1mm == 79/1086px
Blocks: Shield spacing / 62.99 - 3.89 - 3.23 = 55.87